# EAGLE design Watch-It-TOP (EAGLE 9.5.1)
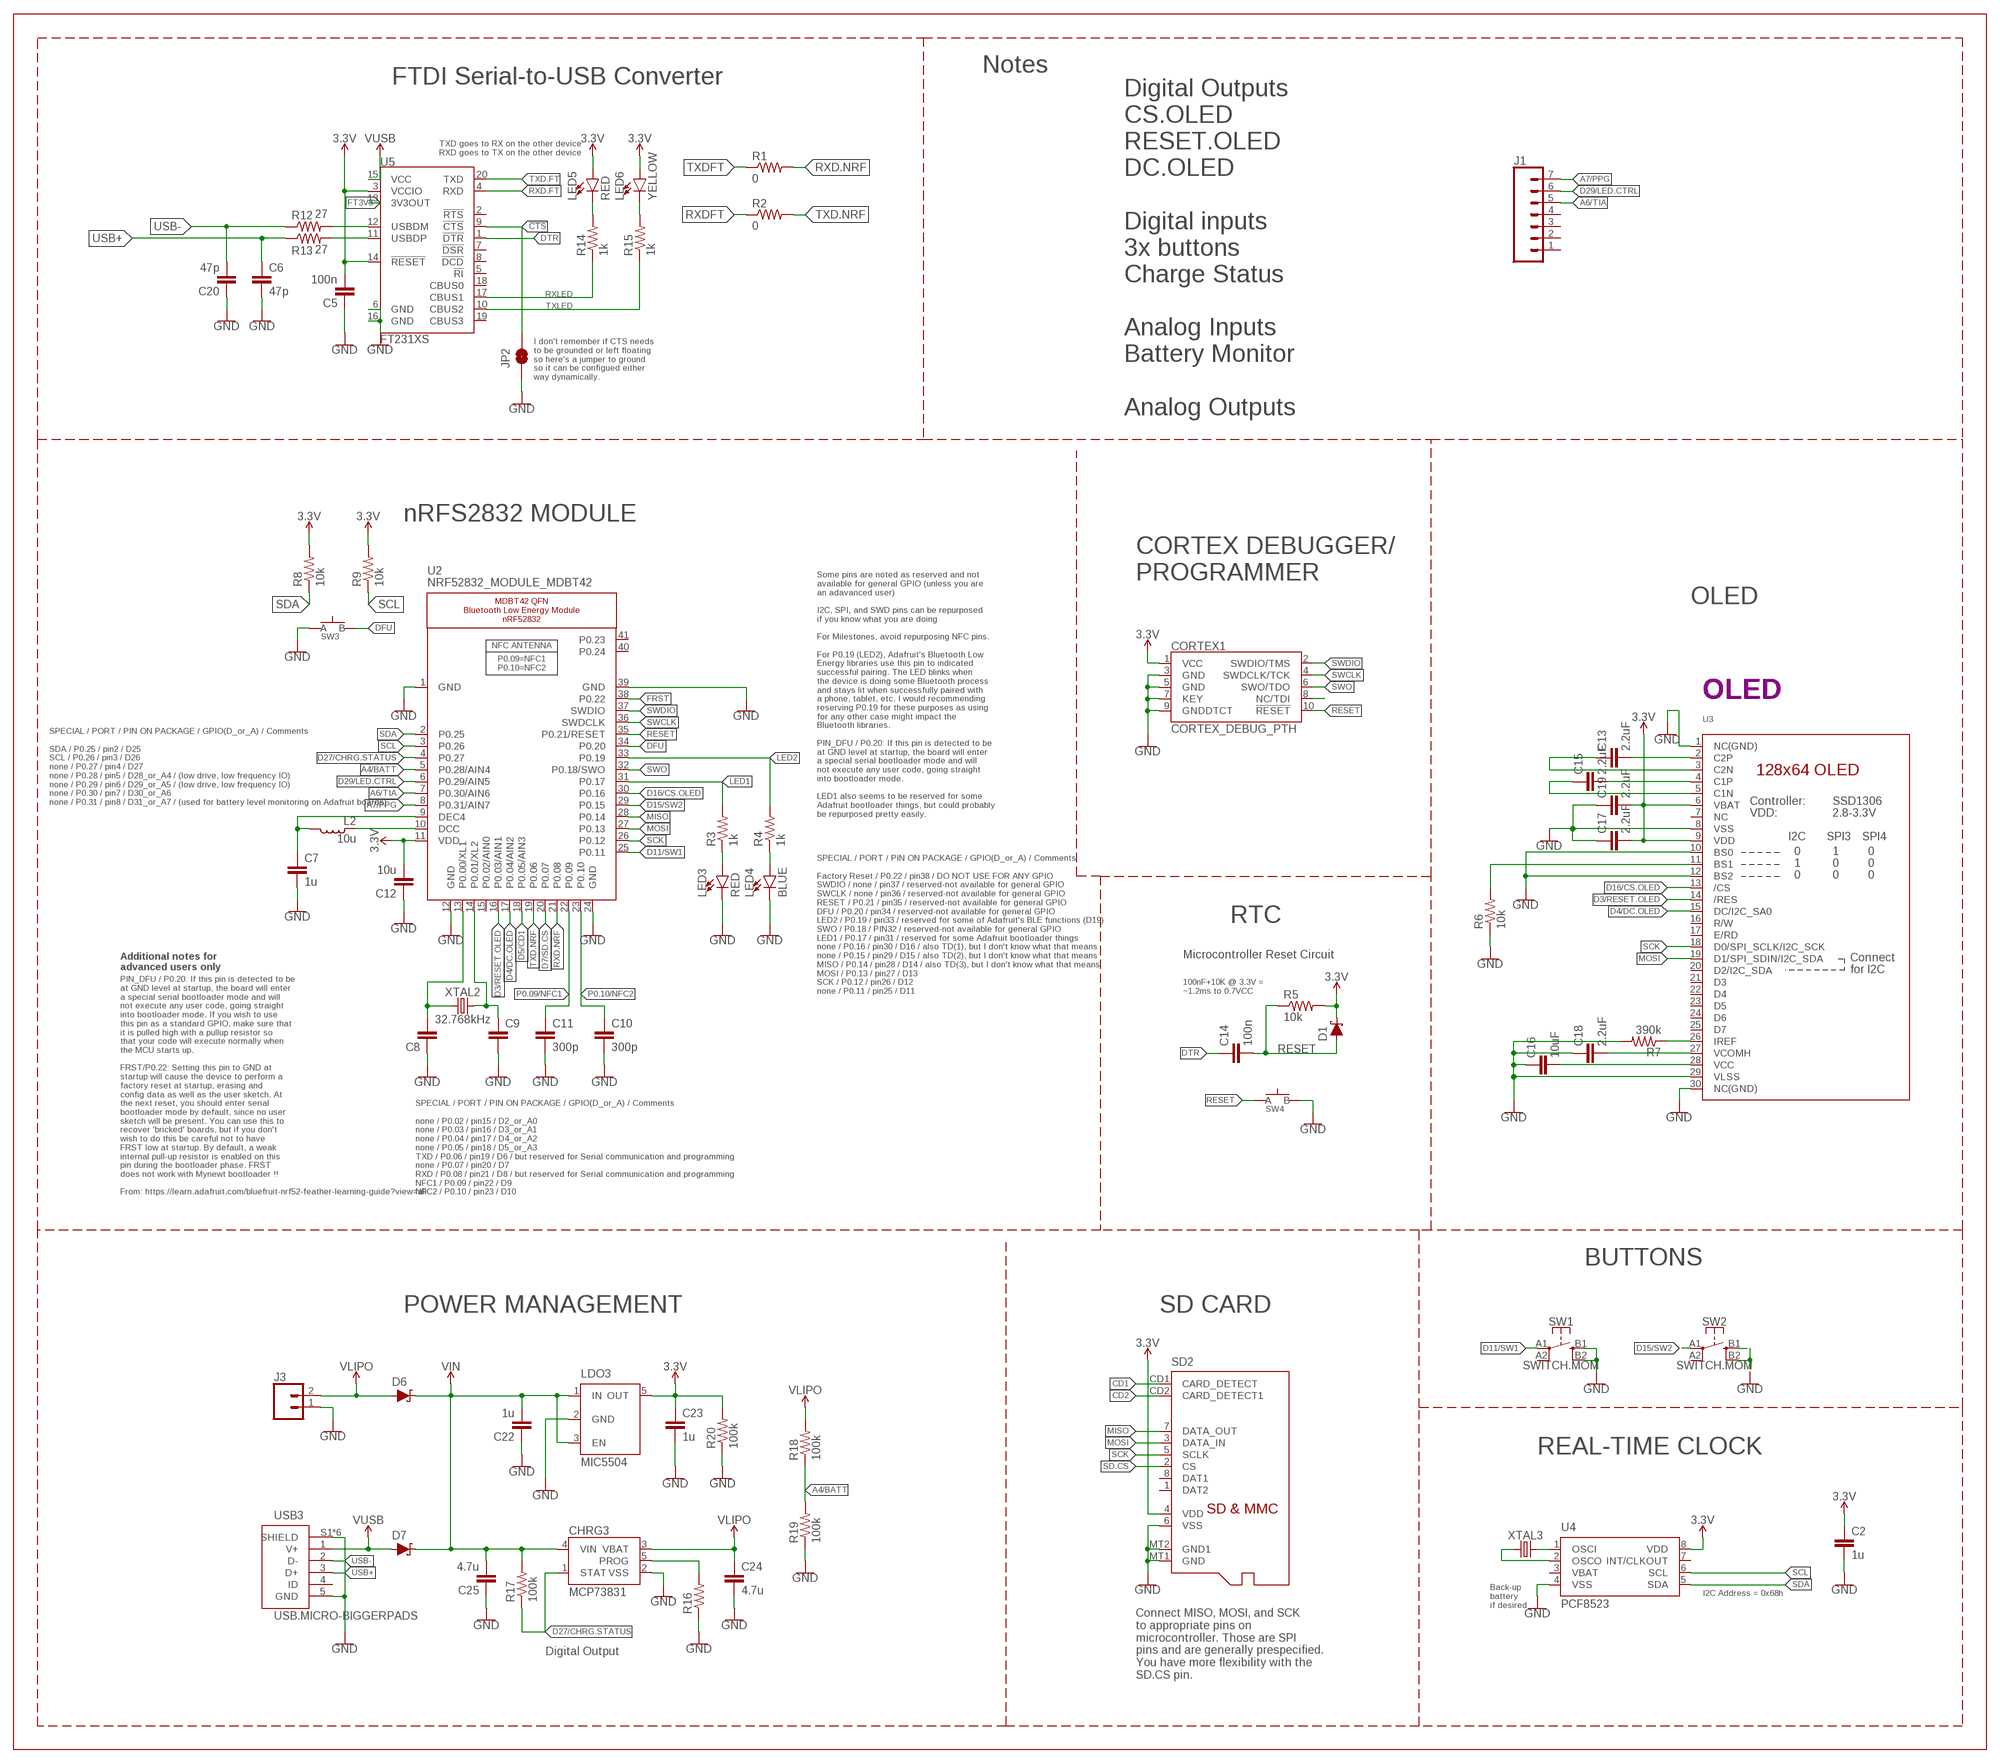
[diagram p0: schematic, sheet 1]

## Parts
C2  1u  CAPACITOR0603  [C0603]
C5  100n  CAPACITOR0603  [C0603]
C6  47p  CAPACITOR0603  [C0603]
C7  1u  CAPACITOR0603  [C0603]
C8  CAPACITOR0603  [C0603]
C9  CAPACITOR0603  [C0603]
C10  300p  CAPACITOR0603  [C0603]
C11  300p  CAPACITOR0603  [C0603]
C12  10u  CAPACITOR0805  [C0805]
C13  2.2uF  CAPACITOR0402  [C0402]
C14  100n  CAPACITOR0603  [C0603]
C15  2.2uF  CAPACITOR0402  [C0402]
C16  10uF  CAPACITOR0603  [C0603]
C17  2.2uF  CAPACITOR0402  [C0402]
C18  2.2uF  CAPACITOR0402  [C0402]
C19  2.2uF  CAPACITOR0402  [C0402]
C20  47p  CAPACITOR0603  [C0603]
C22  1u  CAPACITOR0603  [C0603]
C23  1u  CAPACITOR0603  [C0603]
C24  4.7u  CAPACITOR0603  [C0603]
C25  4.7u  CAPACITOR0603  [C0603]
CHRG3  MCP73831  [SOT23-5]
CORTEX1  CORTEX_DEBUG_PTH  [2X5-PTH-1.27MM]
D1  SCHOTTKY-USC  [USC]
D6  SCHOTTKY-USC  [USC]
D7  SCHOTTKY-USC  [USC]
J1  CONN_07  [1X07]
J3  CONN_02  [1X02]
JP2  JUMPER-SMT_2_NO_SILK  [SMT-JUMPER_2_NO_SILK]
L2  10u  INDUCTOR0603  [L0603]
LDO3  MIC5504  [SOT23-5]
LED3  RED  LED0603  [LED-0603]
LED4  BLUE  LED0603  [LED-0603]
LED5  RED  LED0603  [LED-0603]
LED6  YELLOW  LED0603  [LED-0603]
R1  0  RESISTOR0603  [R0603]
R2  0  RESISTOR0603  [R0603]
R3  1k  RESISTOR0603  [R0603]
R4  1k  RESISTOR0603  [R0603]
R5  10k  RESISTOR0603  [R0603]
R6  10k  RESISTOR0603  [R0603]
R7  390k  RESISTOR0603  [R0603]
R8  10k  RESISTOR0603  [R0603]
R9  10k  RESISTOR0603  [R0603]
R12  27  RESISTOR0603  [R0603]
R13  27  RESISTOR0603  [R0603]
R14  1k  RESISTOR0603  [R0603]
R15  1k  RESISTOR0603  [R0603]
R16  RESISTOR0603  [R0603]
R17  100k  RESISTOR0603  [R0603]
R18  100k  RESISTOR0603  [R0603]
R19  100k  RESISTOR0603  [R0603]
R20  100k  RESISTOR0603  [R0603]
SD2  MICROSD  [MICROSD]
SW1  SWITCH.MOM  [TACTILE_SWITCH_SMD_6.2MM_TALL]
SW2  SWITCH.MOM  [TACTILE_SWITCH_SMD_6.2MM_TALL]
SW3  SPST-PTS830GG140-COPY.1-3  [BUTTON-GULLWING]
SW4  SPST-PTS830GG140-COPY.1-3  [BUTTON-GULLWING]
U2  NRF52832_MODULE_MDBT42  [BLE_MODULE_RAYTAC_MDBT42]
U3  DISP_OLED_UG-2864HSWEG01-NO-WRAPAROUND  [UG-2864HSWEG01_0.96IN_NO-WRAPAROUND]
U4  PCF8523  [SO8]
U5  FT231XS  [SSOP20_L]
USB3  USB.MICRO-BIGGERPADS  [USB-MICRO-01.BIGGERPADS]
XTAL2  32.768kHz  CRYSTALECS-.327-12.5-12-C-TR  [2-SMD.NOLEAD.2.0MMTO1.2MM]
XTAL3  32.7680kHz  CRYSTALECS-.327-12.5-12-C-TR  [2-SMD.NOLEAD.2.0MMTO1.2MM]

## Nets
3.3V: C2.1 C5.2 C12.2 C17.2 C19.2 C23.1 CORTEX1.1(VCC) D1.-(C) LDO3.5(OUT) LED5.A LED6.A R5.2 R8.2 R9.2 R20.2 SD2.4(VDD) U2.11(VDD) U3.6(VBAT) U3.9(VDD) U4.8(VDD) U5.3(VCCIO) U5.14(!RESET)
!CTS: JP2.2 U5.9(!CTS)
A4/BATT: R18.1 R19.2 U2.5(P0.28/AIN4)
A6/TIA: J1.5 U2.7(P0.30/AIN6)
A7/PPG: J1.7 U2.8(P0.31/AIN7)
CD1: SD2.CD1(CARD_DETECT)
CD2: SD2.CD2(CARD_DETECT1)
D3/RESET.OLED: U2.16(P0.03/AIN1) U3.14(/RES)
D4/DC.OLED: U2.17(P0.04/AIN2) U3.15(DC/I2C_SA0)
D5/CD1: U2.18(P0.05/AIN3)
D7/SD.CS: U2.20(P0.07)
D11/SW1: SW1.A1 U2.25(P0.11)
D15/SW2: SW2.A1 U2.29(P0.15)
D16/CS.OLED: U2.30(P0.16) U3.13(/CS)
D27/CHRG.STATUS: CHRG3.1(STAT) R17.1 U2.4(P0.27)
D29/LED.CTRL: J1.6 U2.6(P0.29/AIN5)
DFU: SW3.3(B) U2.34(P0.20)
DTR: C14.1 U5.1(!DTR)
FRST: U2.38(P0.22)
FT3V3: U5.13(3V3OUT)
GND: C2.2 C5.1 C6.2 C7.2 C8.1 C9.2 C10.2 C11.2 C12.1 C16.1 C17.1 C18.1 C19.1 C20.1 C22.1 C23.2 C24.2 C25.1 CHRG3.2(VSS) CORTEX1.3(GND) CORTEX1.5(GND) CORTEX1.7(KEY) CORTEX1.9(GNDDTCT) J3.1 JP2.1 LDO3.2(GND) LED3.C LED4.C R6.1 R7.2 R16.1 R19.1 R20.1 SD2.6(VSS) SD2.MT1(GND) SD2.MT2(GND1) SW1.B1 SW1.B2 SW2.B1 SW2.B2 SW3.1(A) SW4.3(B) U2.1(GND) U2.12(GND) U2.24(GND) U2.39(GND) U3.1(NC(GND)) U3.8(VSS) U3.10(BS0) U3.12(BS2) U3.29(VLSS) U3.30(NC(GND)) U4.4(VSS) U5.6(GND) U5.16(GND) USB3.5(GND) USB3.S1(SHIELD) USB3.S2(SHIELD) USB3.S3(SHIELD) USB3.S4(SHIELD) USB3.S5(SHIELD) USB3.S6(SHIELD)
LED1: R3.2 U2.31(P0.17)
LED2: R4.2 U2.33(P0.19)
MISO: SD2.7(DATA_OUT) U2.28(P0.14)
MOSI: SD2.3(DATA_IN) U2.27(P0.13) U3.19(D1/SPI_SDIN/I2C_SDA)
N$1: R6.2 U3.11(BS1)
N$2: R7.1 U3.26(IREF)
N$3: C13.2 U3.2(C2P)
N$4: C8.2 U2.13(P0.00/XL1) XTAL2.P$1
N$5: C13.1 U3.3(C2N)
N$6: C9.1 U2.14(P0.01/XL2) XTAL2.P$2
N$7: C15.2 U3.4(C1P)
N$8: C15.1 U3.5(C1N)
N$9: LED3.A R3.1
N$10: LED4.A R4.1
N$11: L2.1 U2.10(DCC)
N$12: C7.1 L2.2 U2.9(DEC4)
N$13: C16.2 U3.28(VCC)
N$14: CORTEX1.8(NC/TDI)
N$15: C18.2 U3.27(VCOMH)
N$18: CHRG3.5(PROG) R16.2
N$19: U4.2(OSCO) XTAL3.P$1
N$20: U4.1(OSCI) XTAL3.P$2
N$23: R12.2 U5.12(USBDM)
N$24: R13.2 U5.11(USBDP)
N$25: LED5.C R14.2
N$26: LED6.C R15.2
P0.09/NFC1: C11.1 U2.22(P0.09)
P0.10/NFC2: C10.1 U2.23(P0.10)
RESET: C14.2 CORTEX1.10(!RESET) D1.+(A) R5.1 SW4.1(A) U2.35(P0.21/RESET)
RXD.FT: U5.4(RXD)
RXD.NRF: R1.2 U2.21(P0.08)
RXDFT: R2.1
RXLED: R14.1 U5.17(CBUS1)
SCK: SD2.5(SCLK) U2.26(P0.12) U3.18(D0/SPI_SCLK/I2C_SCK)
SCL: R9.1 U2.3(P0.26) U4.6(SCL)
SD.CS: SD2.2(CS)
SDA: R8.1 U2.2(P0.25) U4.5(SDA)
SWCLK: CORTEX1.4(SWDCLK/TCK) U2.36(SWDCLK)
SWDIO: CORTEX1.2(SWDIO/TMS) U2.37(SWDIO)
SWO: CORTEX1.6(SWO/TDO) U2.32(P0.18/SWO)
TXD.FT: U5.20(TXD)
TXD.NRF: R2.2 U2.19(P0.06)
TXDFT: R1.1
TXLED: R15.1 U5.10(CBUS2)
USB+: C6.1 R13.1 USB3.3(D+)
USB-: C20.2 R12.1 USB3.2(D-)
V_USB: D7.+(A) U5.15(VCC) USB3.1(V+) ; supply symbol labelled VUSB
VIN: C22.2 C25.2 CHRG3.4(VIN) D6.-(C) D7.-(C) LDO3.1(IN) LDO3.3(EN) R17.2
VLIPO: C24.1 CHRG3.3(VBAT) D6.+(A) J3.2 R18.2
Unconnected: J1.1 J1.2 J1.3 J1.4 SD2.1(DAT2) SD2.8(DAT1) SW1.A2 SW2.A2 U2.15(P0.02/AIN0) U2.40(P0.24) U2.41(P0.23) U3.7(NC) U3.16(R/W) U3.17(E/RD) U3.20(D2/I2C_SDA) U3.21(D3) U3.22(D4) U3.23(D5) U3.24(D6) U3.25(D7) U4.7(INT/CLKOUT) U5.2(!RTS) U5.5(!RI) U5.7(!DSR) U5.8(!DCD) U5.18(CBUS0) U5.19(CBUS3) USB3.4(ID)

## Notes on the sheet
- Notes
- FTDI Serial-to-USB Converter
- TXD goes to RX on the other device
  RXD goes to TX on the other device
- I don't remember if CTS needs
  to be grounded or left floating
  so here's a jumper to ground
  so it can be configued either
  way dynamically.
- Digital Outputs
  CS.OLED
  RESET.OLED
  DC.OLED
  
  Digital inputs
  3x buttons
  Charge Status
  
  Analog Inputs
  Battery Monitor
  
  Analog Outputs
- nRFS2832 MODULE
- CORTEX DEBUGGER/ 
  PROGRAMMER
- OLED
- OLED
- SPECIAL / PORT / PIN ON PACKAGE / GPIO(D_or_A) / Comments
  
  SDA / P0.25 / pin2 / D25
  SCL / P0.26 / pin3 / D26
  none / P0.27 / pin4 / D27
  none / P0.28 / pin5 / D28_or_A4 / (low drive, low frequency IO)
  none / P0.29 / pin6 / D29_or_A5 / (low drive, low frequency IO)
  none / P0.30 / pin7 / D30_or_A6
  none / P0.31 / pin8 / D31_or_A7 / (used for battery level monitoring on Adafruit boards)
- Some pins are noted as reserved and not
  available for general GPIO (unless you are
  an adavanced user)
  
  I2C, SPI, and SWD pins can be repurposed
  if you know what you are doing
  
  For Milestones, avoid repurposing NFC pins.
  
  For P0.19 (LED2), Adafruit's Bluetooth Low
  Energy libraries use this pin to indicated
  successful pairing. The LED blinks when
  the device is doing some Bluetooth process
  and stays lit when successfully paired with
  a phone, tablet, etc. I would recommending
  reserving P0.19 for these purposes as using
  for any other case might impact the
  Bluetooth libraries.
  
  PIN_DFU / P0.20: If this pin is detected to be
  at GND level at startup, the board will enter
  a special serial bootloader mode and will
  not execute any user code, going straight
  into bootloader mode.
  
  LED1 also seems to be reserved for some
  Adafruit bootloader things, but could probably
  be repurposed pretty easily.
- RTC
- Microcontroller Reset Circuit
- Additional notes for
  advanced users only
- SPECIAL / PORT / PIN ON PACKAGE / GPIO(D_or_A) / Comments
  
  Factory Reset / P0.22 / pin38 / DO NOT USE FOR ANY GPIO
  SWDIO / none / pin37 / reserved-not available for general GPIO
  SWCLK / none / pin36 / reserved-not available for general GPIO
  RESET / P0.21 / pin35 / reserved-not available for general GPIO
  DFU / P0.20 / pin34 / reserved-not available for general GPIO
  LED2 / P0.19 / pin33 / reserved for some of Adafruit's BLE functions (D19)
  SWO / P0.18 / PIN32 / reserved-not available for general GPIO
  LED1 / P0.17 / pin31 / reserved for some Adafruit bootloader things
  none / P0.16 / pin30 / D16 / also TD(1), but I don't know what that means
  none / P0.15 / pin29 / D15 / also TD(2), but I don't know what that means
  MISO / P0.14 / pin28 / D14 / also TD(3), but I don't know what that means
  MOSI / P0.13 / pin27 / D13
  SCK / P0.12 / pin26 / D12
  none / P0.11 / pin25 / D11
- 100nF+10K @ 3.3V =
  ~1.2ms to 0.7VCC
- PIN_DFU / P0.20: If this pin is detected to be
  at GND level at startup, the board will enter
  a special serial bootloader mode and will
  not execute any user code, going straight
  into bootloader mode. If you wish to use
  this pin as a standard GPIO, make sure that
  it is pulled high with a pullup resistor so
  that your code will execute normally when
  the MCU starts up.
  
  FRST/P0.22: Setting this pin to GND at
  startup will cause the device to perform a
  factory reset at startup, erasing and
  config data as well as the user sketch. At
  the next reset, you should enter serial
  bootloader mode by default, since no user
  sketch will be present. You can use this to
  recover 'bricked' boards, but if you don't
  wish to do this be careful not to have
  FRST low at startup. By default, a weak
  internal pull-up resistor is enabled on this
  pin during the bootloader phase. FRST
  does not work with Mynewt bootloader !!
  
  From: https://learn.adafruit.com/bluefruit-nrf52-feather-learning-guide?view=all
- SPECIAL / PORT / PIN ON PACKAGE / GPIO(D_or_A) / Comments
  
  none / P0.02 / pin15 / D2_or_A0
  none / P0.03 / pin16 / D3_or_A1
  none / P0.04 / pin17 / D4_or_A2
  none / P0.05 / pin18 / D5_or_A3
  TXD / P0.06 / pin19 / D6 / but reserved for Serial communication and programming
  none / P0.07 / pin20 / D7
  RXD / P0.08 / pin21 / D8 / but reserved for Serial communication and programming
  NFC1 / P0.09 / pin22 / D9
  NFC2 / P0.10 / pin23 / D10
- BUTTONS
- POWER MANAGEMENT | SD CARD
- REAL-TIME CLOCK
- I2C Address = 0x68h
- Back-up
  battery
  if desired
- Digital Output
- Connect MISO, MOSI, and SCK
  to appropriate pins on
  microcontroller. Those are SPI
  pins and are generally prespecified.
  You have more flexibility with the
  SD.CS pin.

## Power pins joined to a net without a drawn wire
VBAT: U4.3(VBAT)

## Library data of the parts
C2 C5-C20 C22-C25 = LinnesLab-Passives:CAPACITOR
CHRG3 = LinnesLab-Power:MCP73831: MCP73831T Li-Ion, Li-Pol Controller Miniature single cell, fully integrated Li-Ion, Li-polymer charge management controller Datasheet <http://ww1.microchip.com/downloads/en/DeviceDoc/20001984g.pdf> SparkFun Products: SparkFun ESP32 Thing <https://www.sparkfun.com/products/13907> SparkFun 9DoF Razor IMU M0 <https://www.sparkfun.com/products/14001>; PROD_ID: IC-09995
CORTEX1 = LinnesLab-Connectors:CORTEX_DEBUG: Cortex Debug Connector - 10 pin Supports JTAG debug, Serial Wire debug, and Serial Wire Viewer. PTH and SMD connector options available. General Connector Information <http://infocenter.arm.com/help/topic/com.arm.doc.faqs/attached/13634/cortex_debug_connectors.pdf> Products: PTH Connector <http://www.digikey.com/product-detail/en/cnc-tech/3220-10-0100-00/1175-1627-ND/3883661> -via Digi-Key SparkFun PSoc <https://www.sparkfun.com/products/13229> SparkFun T <https://www.sparkfun.com/products/13810>
D1 D6 D7 = LinnesLab-DiscreteSemi:SCHOTTKY: Schottky diode A Schottky diode is a semiconductor diode which has a low forward voltage drop and a very fast switching action. Example: Digi-Key Part Number: RB161MM-20CT-ND
J1 = LinnesLab-Connectors:CONN_07: Multi connection point. Often used as Generic Header-pin footprint for 0.1 inch spaced/style header connections On any of the 0.1 inch spaced packages, you can populate with these: Break Away Headers - Straight <https://www.sparkfun.com/products/116> (PRT-00116) Break Away Male Headers - Right Angle <https://www.sparkfun.com/products/553> (PRT-00553) Female Headers <https://www.sparkfun.com/products/115> (PRT-00115) Break Away Headers - Machine Pin <https://www.sparkfun.com/products/117> (PRT-00117) Break Away Female Headers - Swiss Machine Pin <https://www.sparkfun.com/products/743> (PRT-00743) For SCREWTERMINALS and SPRING TERMINALS visit here: Screw Terimnals on SparkFun.com <https://www.sparkfun.com/search/results?term=Screw+Terminals> (5mm/3.5mm/2.54mm spacing) This device is also useful as a general connection point to wire up your design to another part of your project. Our various solder wires solder well into these plated through hole pads. Hook-Up Wire - Assortment (Stranded, 22 AWG) <https://www.sparkfun.com/products/11375> (PRT-11375) Hook-Up Wire - Assortment (Solid Core, 22 AWG) <https://www.sparkfun.com/products/11367> (PRT-11367) View the entire wire category on our website here <https://www.sparkfun.com/categories/141> Special notes: Molex polarized connector foot print use with SKU : PRT-08231 with associated crimp pins and housings. 1MM SMD Version SKU: PRT-10208 NOTES ON THE VARIANTS LOCK and LOCK_LONGPADS... This footprint was designed to help hold the alignment of a through-hole component (i.e. 6-pin header) while soldering it into place. You may notice that each hole has been shifted either up or down by 0.005 of an inch from it's more standard position (which is a perfectly straight line). This slight alteration caused the pins (the squares in the middle) to touch the edges of the holes. Because they are alternating, it causes a "brace" to hold the component in place. 0.005 has proven to be the perfect amount of "off-center" position when using our standard breakaway headers. Although looks a little odd when you look at the bare footprint, once you have a header in there, the alteration is very hard to notice. Also,if you push a header all the way into place, it is covered up entirely on the bottom side.
J3 = LinnesLab-Connectors:CONN_02: Multi connection point. Often used as Generic Header-pin footprint for 0.1 inch spaced/style header connections On any of the 0.1 inch spaced packages, you can populate with these: Break Away Headers - Straight <https://www.sparkfun.com/products/116> (PRT-00116) Break Away Male Headers - Right Angle <https://www.sparkfun.com/products/553> (PRT-00553) Female Headers <https://www.sparkfun.com/products/115> (PRT-00115) Break Away Headers - Machine Pin <https://www.sparkfun.com/products/117> (PRT-00117) Break Away Female Headers - Swiss Machine Pin <https://www.sparkfun.com/products/743> (PRT-00743) For SCREWTERMINALS and SPRING TERMINALS visit here: Screw Terimnals on SparkFun.com <https://www.sparkfun.com/search/results?term=Screw+Terminals> (5mm/3.5mm/2.54mm spacing) This device is also useful as a general connection point to wire up your design to another part of your project. Our various solder wires solder well into these plated through hole pads. Hook-Up Wire - Assortment (Stranded, 22 AWG) <https://www.sparkfun.com/products/11375> (PRT-11375) Hook-Up Wire - Assortment (Solid Core, 22 AWG) <https://www.sparkfun.com/products/11367> (PRT-11367) View the entire wire category on our website here <https://www.sparkfun.com/categories/141> Special notes: Molex polarized connector foot print use with: PRT-08233 with associated crimp pins and housings. 2.54_SCREWTERM for use with PRT-10571. 3.5mm Screw Terminal footprints for PRT-08084 5mm Screw Terminal footprints for use with PRT-08432
JP2 = LinnesLab-Switches:JUMPER-SMT_2_NO: Normally open jumper This jumper has two pads in close proximity to each other. Apply solder to close the connection. Round pads are easier to solder for beginners, but are a lot larger. SparkFun Product that uses the round pads: SparkFun EL Sequencer <https://www.sparkfun.com/products/12781>
L2 = LinnesLab-Passives:INDUCTOR
LDO3 = LinnesLab-Power:MIC5504: MIC5504 Voltage Regulator Output Voltages: 1.0V to 3.3V Input Voltages: 2.5V to 5.5V Link to Datasheet http://ww1.microchip.com/downloads/en/DeviceDoc/MIC550X.pdf
LED3-LED6 = LinnesLab-LED:LED: LED (Generic) Standard schematic elements and footprints for 5mm, 3mm, 1206, and 0603 sized LEDs. Generic LEDs with no color specified. LTST-C190KGKT: arrow indicates cathode
R1-R9 R12-R20 = LinnesLab-Passives:RESISTOR
SD2 = LinnesLab-Connectors:MICROSD: Micro-SD / Transflash card holder with SPI pinout For the 3M # 2908-05WB-MG and/or 4UCON #19656 push-push type
SW1 SW2 = LinnesLab-Switches:SWITCH.MOM: PTS645SM43SMTR92 LFS
SW3 SW4 = LinnesLab-Switches:SPST-PTS830GG140-COPY
U2 = LinnesLab-Microcontrollers:NRF52832_MODULE_MDBT42: MDBT42 - BLE Module (nRF52832 QFN) VDD: 1.7-3.6V
U3 = LinnesLab-Displays:DISP_OLED_UG-2864HSWEG01: UG-2864HSWEG01 OLED display Both 1.3" and 0.96" models share the same FPC tab footprint, only the screen dimensions vary.
U4 = LinnesLab-Clocks:PCF8523; DIGIKEY: 568-5306-1-ND; I2C_ADDRESS: 0x68h; MFN: PCF8523T/1,118; MFN_MANUFACTURER: NXP USA Inc.
U5 = LinnesLab-DigitalIC:FT231X: FTDI FT231X Full Speed USB to Full-handshake UART This USB2.0 Full Speed IC offers a compact bridge to full handshake UART interfaces. The device is a UART, capable of operating up to 3MBaud, with low power consumption (8mA). The FT231X includes the complete FT-X series feature set and enables USB to be added into a system design quickly and easily over a UART interface. Datasheet <http://cdn.sparkfun.com/datasheets/Components/General%20IC/DS_FT231X.pdf>; DIGIKEY: 768-1156-5-ND; MFN: FT231XS-U
USB3 = LinnesLab-Connectors:USB.MICRO: DigiKey PN: 609-4613-1-ND
XTAL2 XTAL3 = LinnesLab-Clocks:CRYSTAL; DIGIKEY: XC2288CT-ND; FREQ: 32.7680KHZ; LOAD_CAP: 12.5pF

## Board
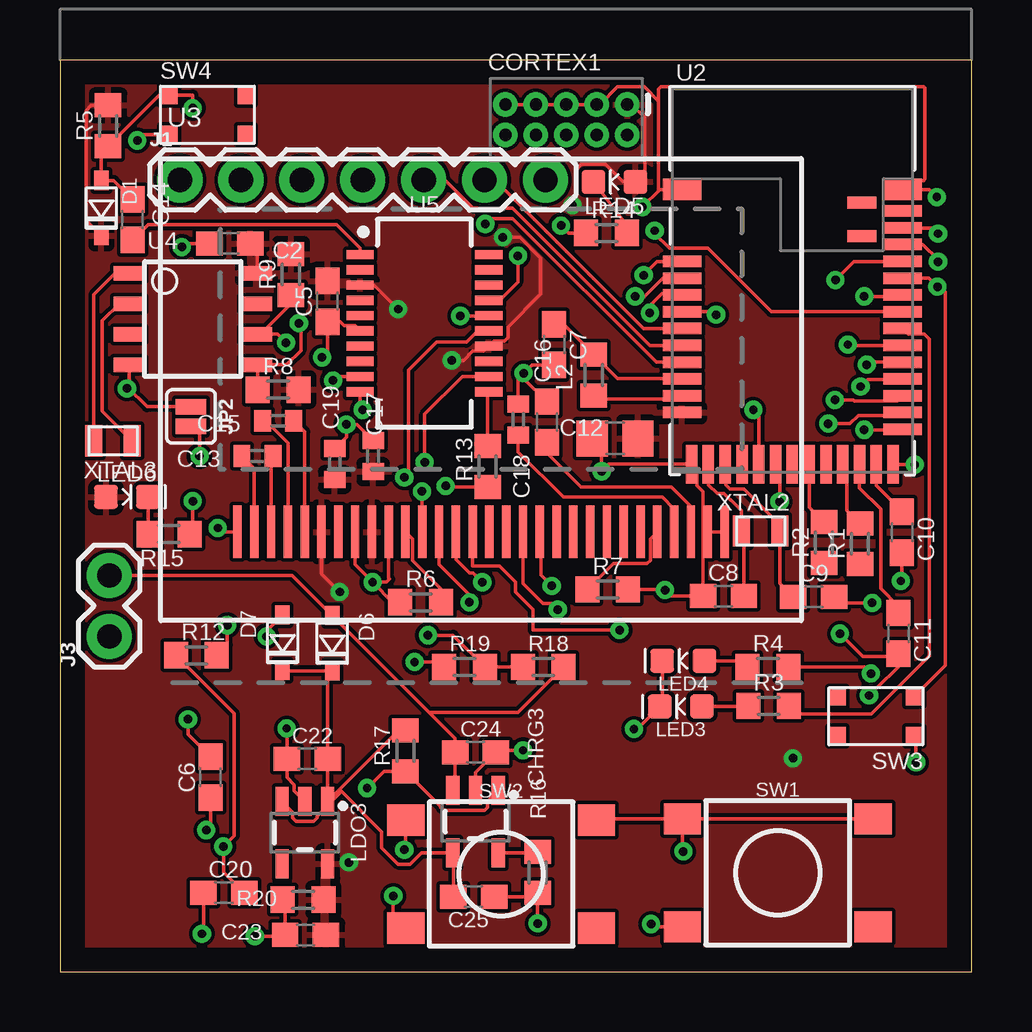
[diagram p1: board, top side]
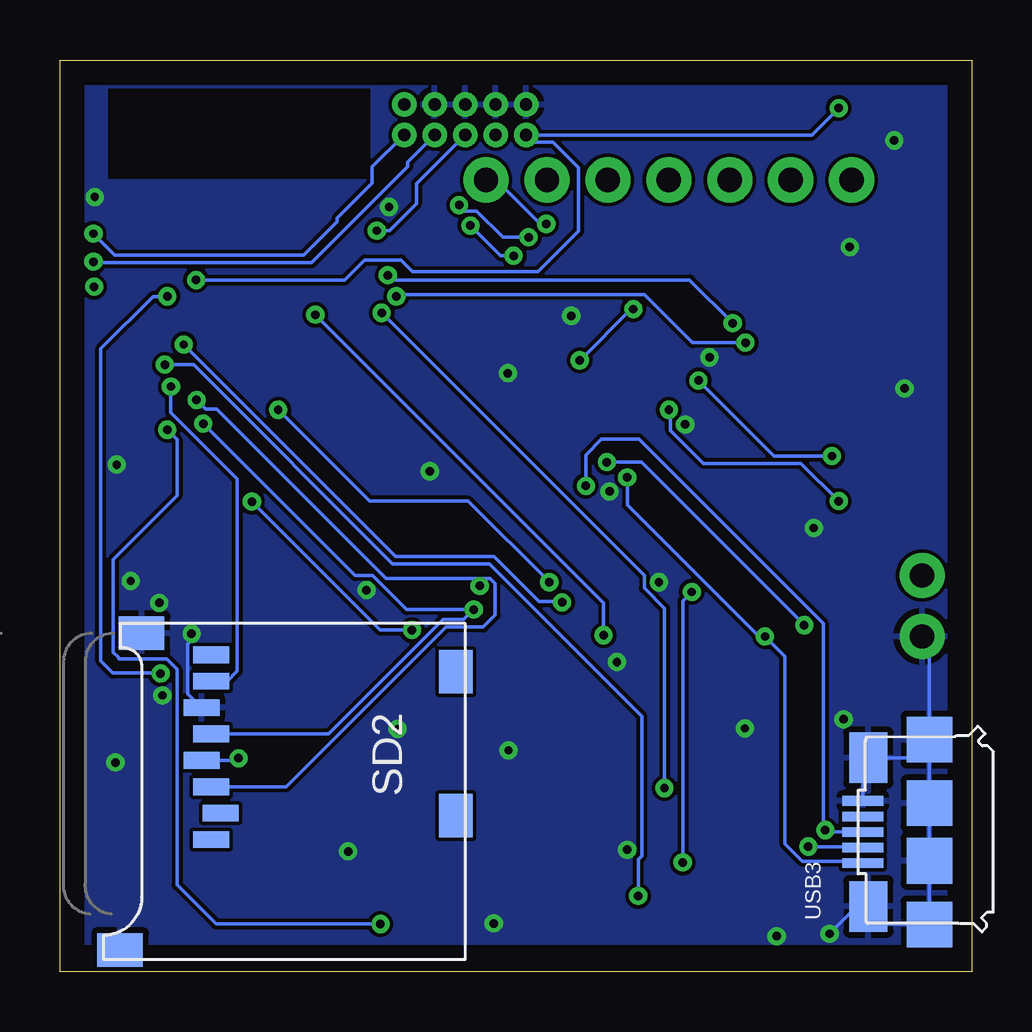
[diagram p2: board, bottom side, seen from below]

Size 38 x 38 mm. Coordinates in mm from the lower left corner, seen from the top.
Outline: 0,0 38,0 38,38 0,38 0,0
Copper layers (1*16): Top 0.035mm / dielectric 1.5mm / Bottom 0.035mm
Design rules "default": minimum track width 6mil, minimum drill 0.35mm, track to track 6mil, track to pad 6mil, pad to pad 6mil, via to via 6mil, smd to smd 6mil, copper to edge 40mil, drill to drill 6mil, minimum pad ring 10mil, minimum via ring 8mil, stop-mask expansion 4mil, vias tented up to drill 0mil, thermal gap 10mil

### Footprints (pad centres in the part's own frame; a part is rotated, then mirrored left to right if it is on the bottom)
C0603 = smd 1.1 x 1: 1 -0.85,0; 2 0.85,0
C0805 = smd 1.3 x 1.5: 1 -0.95,0; 2 0.95,0
C0402 = smd 0.7 x 0.9: 1 -0.65,0; 2 0.65,0
SOT23-5 = smd 0.55 x 1.2: 1 -0.95,-1.3; 2 0,-1.3; 3 0.95,-1.3; 4 0.95,1.3; 5 -0.95,1.3
2X5-PTH-1.27MM = drill 0.508 pad 1: 1 -2.54,-0.635; 2 -2.54,0.635; 3 -1.27,-0.635; 4 -1.27,0.635; 5 0,-0.635; 6 0,0.635; 7 1.27,-0.635; 8 1.27,0.635; 9 2.54,-0.635; 10 2.54,0.635
USC = smd 0.8 x 0.6: + -1.15,0; - 1.15,0
1X07 = drill 1.016 pad 1.88: 1 0,0; 2 2.54,0; 3 5.08,0; 4 7.62,0; 5 10.16,0; 6 12.7,0; 7 15.24,0
1X02 = drill 1.016 pad 1.88: 1 0,0; 2 2.54,0
SMT-JUMPER_2_NO_SILK = smd 0.635 x 1.27: 1 -0.406,0; 2 0.406,0
L0603 = smd 1 x 1.1: 1 -0.85,0; 2 0.85,0
LED-0603 = smd 1 x 1: A -0.877,0; C 0.877,0
R0603 = smd 1 x 1.1: 1 -0.85,0; 2 0.85,0
MICROSD = smd 0.7 x 1.5: 1 9,-10.64; 2 7.9,-10.24; 3 6.8,-10.64; 4 5.7,-11.04; 5 4.6,-10.64; 6 3.5,-11.04; 7 2.4,-10.64; 8 1.3,-10.64 | smd 1.8 x 1.4: CD1 2,-0.44; CD2 8,-0.44 | smd 1.4 x 1.9: MT1 0.4,-13.54; MT2 13.6,-14.44
TACTILE_SWITCH_SMD_6.2MM_TALL = smd 1.55 x 1.3: A1 -3.975,-2.25; A2 3.975,-2.25; B1 -3.975,2.25; B2 3.975,2.25
BUTTON-GULLWING = smd 0.7 x 0.75: 1 -1.6,0.825; 2 1.6,0.825; 3 -1.6,-0.825; 4 1.6,-0.825
BLE_MODULE_RAYTAC_MDBT42 = smd 1.6 x 0.9: 1 -4.6,3.8; 39 4.6,3.8 | smd 1.6 x 0.48: 2 -4.6,0.8; 3 -4.6,0.1; 4 -4.6,-0.6; 5 -4.6,-1.3; 6 -4.6,-2; 7 -4.6,-2.7; 8 -4.6,-3.4; 9 -4.6,-4.1; 10 -4.6,-4.8; 11 -4.6,-5.5; 25 4.6,-6.2; 26 4.6,-5.5; 27 4.6,-4.8; 28 4.6,-4.1; 29 4.6,-3.4; 30 4.6,-2.7; 31 4.6,-2; 32 4.6,-1.3; 33 4.6,-0.6; 34 4.6,0.1; 35 4.6,0.8; 36 4.6,1.5; 37 4.6,2.2; 38 4.6,2.9 | smd 0.48 x 1.6: 12 -4.2,-7.65; 13 -3.5,-7.65; 14 -2.8,-7.65; 15 -2.1,-7.65; 16 -1.4,-7.65; 17 -0.7,-7.65; 18 0,-7.65; 19 0.7,-7.65; 20 1.4,-7.65; 21 2.1,-7.65; 22 2.8,-7.65; 23 3.5,-7.65; 24 4.2,-7.65 | smd 1.2 x 0.5: 40 2.9,3.25; 41 2.9,1.85
UG-2864HSWEG01_0.96IN_NO-WRAPAROUND = smd 0.35 x 2.2: 1 -10.15,-1.2; 2 -9.45,-1.2; 3 -8.75,-1.2; 4 -8.05,-1.2; 5 -7.35,-1.2; 6 -6.65,-1.2; 7 -5.95,-1.2; 8 -5.25,-1.2; 9 -4.55,-1.2; 10 -3.85,-1.2; 11 -3.15,-1.2; 12 -2.45,-1.2; 13 -1.75,-1.2; 14 -1.05,-1.2; 15 -0.35,-1.2; 16 0.35,-1.2; 17 1.05,-1.2; 18 1.75,-1.2; 19 2.45,-1.2; 20 3.15,-1.2; 21 3.85,-1.2; 22 4.55,-1.2; 23 5.25,-1.2; 24 5.95,-1.2; 25 6.65,-1.2; 26 7.35,-1.2; 27 8.05,-1.2; 28 8.75,-1.2; 29 9.45,-1.2; 30 10.15,-1.2
SO8 = smd 1.3 x 0.6: 1 -2.65,1.905; 2 -2.65,0.635; 3 -2.65,-0.635; 4 -2.65,-1.905; 5 2.65,-1.905; 6 2.65,-0.635; 7 2.65,0.635; 8 2.65,1.905
SSOP20_L = smd 0.381 x 1.143: 1 -2.857,-2.68; 2 -2.223,-2.68; 3 -1.587,-2.68; 4 -0.953,-2.68; 5 -0.318,-2.68; 6 0.318,-2.68; 7 0.953,-2.68; 8 1.587,-2.68; 9 2.223,-2.68; 10 2.857,-2.68; 11 2.857,2.68; 12 2.223,2.68; 13 1.587,2.68; 14 0.953,2.68; 15 0.318,2.68; 16 -0.318,2.68; 17 -0.953,2.68; 18 -1.587,2.68; 19 -2.223,2.68; 20 -2.857,2.68
USB-MICRO-01.BIGGERPADS = smd 0.4 x 1.7: 1 -1.3,1.505; 2 -0.65,1.505; 3 0,1.505; 4 0.65,1.505; 5 1.3,1.505 | smd 1.9 x 1.9: S1 -3.85,-1.27; S2 -1.2,-1.27; S3 1.2,-1.27; S4 3.85,-1.27 | smd 2.1 x 1.6: S5 -3.1,1.28; S6 3.1,1.28
2-SMD.NOLEAD.2.0MMTO1.2MM = smd 0.7 x 1.3: P$1 -0.8,0; P$2 0.8,0

### Placement (x,y rotation side)
C2  7.09,30.35 180 top
C5  11.15,27.94 90 top
C6  6.27,8.1 90 top
C7  20.6,26.14 270 top
C8  27.66,15.65 0 top
C9  31.42,15.62 0 top
C10  35.1,18.31 270 top
C11  34.95,14.1 270 top
C12  23.14,22.23 0 top
C13  8.23,21.49 180 top
C14  3.02,31.34 90 top
C15  9.09,22.96 180 top
C16  20.29,22.91 270 top
C17  13.06,21.49 270 top
C18  19.1,23.01 270 top
C19  11.46,21.16 270 top
C20  6.83,3.28 0 top
C22  10.31,8.86 0 top
C23  10.24,1.52 180 top
C24  17.32,9.14 0 top
C25  17.25,3.12 180 top
CHRG3  17.32,6.25 180 top
CORTEX1  21.11,35.51 180 top
D1  1.73,31.83 270 top
D6  11.35,13.69 270 top
D7  9.27,13.72 270 top
J1  5,33 0 top
J3  2.06,13.97 90 top
JP2  5.46,23.14 270 top
L2  22.25,24.87 90 top
LDO3  10.21,5.79 180 top
LED3  25.88,11.05 180 top
LED4  25.98,12.95 180 top
LED5  23.11,32.92 180 top
LED6  2.79,19.79 0 top
R1  33.35,17.83 90 top
R2  31.85,17.88 90 top
R3  29.54,11.07 0 top
R4  29.51,12.7 0 top
R5  2.01,35.26 90 top
R6  15.04,15.39 0 top
R7  22.83,15.93 0 top
R8  9.09,24.26 0 top
R9  9.63,29.06 90 top
R12  5.69,13.18 0 top
R13  17.83,21.06 90 top
R14  22.78,30.78 0 top
R15  4.55,18.24 180 top
R16  19.91,4.14 90 top
R17  14.4,9.19 90 top
R18  20.14,12.7 0 top
R19  16.87,12.7 0 top
R20  10.13,3 0 top
SD2  21.06,14.5 270 bottom
SW1  29.92,4.11 0 top
SW2  18.39,4.06 0 top
SW3  34.01,10.64 180 top
SW4  6.15,35.71 0 top
U2  30.53,28.8 0 top
U3  17.55,19.53 0 top
U4  5.54,27.2 0 top
U5  15.19,27.03 270 top
USB3  3.02,5.82 90 bottom
XTAL2  29.21,18.36 0 top
XTAL3  2.21,22.12 180 top

### Tracks (layer width: path | path; a pad name or v marks a point on that pad's centre or on a via)
3.3V  (via drill 0.35)
  Top 0.152: U4.8 8.22,29.14 8.22,30.07 C2.1 | C5.2 10.74,28.79 | v16.33,25.48 16.82,25.48 17.2,25.86 17.65,25.86 U5.14 18.09,26.29 18.54,26.29 18.67,26.42 18.67,26.87 20.04,28.25 20.04,29.74 19.17,30.61 v18.47,30.61 | v14.1,27.61 13.1,28.61 U5.3 | CORTEX1.1 23.83,36.14 24.38,35.59 24.38,33.31 LED5.A 23.47,32.92 22.74,33.65 21.73,33.65 21.51,33.42 21.51,32.1 v21.36,31.95 | D1.- 1.09,31.31 1.09,35.89 1.31,36.1 R5.2 | U3.6 10.9,16.58 v11.66,15.82 | v12.04,4.55 11.94,4.45
  Bottom 0.152: SD2.4 30.64,8.8 v30.56,8.89 | v16.33,25.48 14.2,27.61 v14.1,27.61 | v21.36,31.95 21.11,31.71 20.64,31.71 19.54,30.61 v18.47,30.61 | v11.66,15.82 12.04,15.44 v12.04,4.55
  pour Top: 0.2,37.74 37.82,37.74 37.82,0.33 0.33,0.33
!CTS  (via drill 0.35)
  Top 0.152: U5.9 11.54,24.8 v11.38,24.64 | v5.82,21.49 5.82,22.38 JP2.2
  Bottom 0.152: v11.38,24.64 8.23,21.49 v5.82,21.49
A4/BATT  (via drill 0.35)
  Top 0.152: v27.36,27.38 27.23,27.5 U2.5 | v15.34,14.02 16.39,14.02 R19.2 R18.1
  Bottom 0.152: v27.36,27.38 15.34,15.37 v15.34,14.02
A6/TIA
  Top 0.152: U2.7 24.59,26.1 18.87,31.83 17.22,31.83 16.05,33 J1.5
A7/PPG  (via drill 0.35)
  Top 0.152: U2.8 24.86,25.4 18.87,31.39 17.96,31.39 v17.73,31.17
  Bottom 0.152: v17.73,31.17 17.97,31.17 19.81,33 J1.7
D3/RESET.OLED  (via drill 0.35)
  Top 0.152: v17.6,16.23 17.22,16.61 17.07,16.61 16.5,17.18 U3.14 | v28.91,23.42 29.13,23.19 U2.16
  Bottom 0.152: v17.6,16.23 20.98,19.61 25.09,19.61 v28.91,23.42
D4/DC.OLED  (via drill 0.35)
  Top 0.152: v23.33,14.23 19.73,14.23 19.73,15.1 19,15.83 19,16.23 18.31,16.92 17.2,16.92 U3.15 | U2.17 30,20.98 v30,19.59
  Bottom 0.152: v30,19.59 24.65,14.23 v23.33,14.23
D11/SW1  (via drill 0.35)
  Top 0.152: SW1.A1 24.75,1.86 v24.64,1.98 | U2.25 35.11,22.58 v33.53,22.58
  Bottom 0.152: v33.53,22.58 33.12,22.17 33.12,19.84 35.77,17.18 35.77,13.31 35.56,13.09 35.56,13.06 35.53,13.03 33.56,13.03 33.12,12.59 33.12,3.61 31.5,1.98 v24.64,1.98
D15/SW2  (via drill 0.35)
  Top 0.152: SW2.A1 13.89,2.33 v13.89,3.15 | v33.63,25.3 33.73,25.4 U2.29
  Bottom 0.152: v13.89,3.15 13.89,4.68 13.74,4.83 13.74,10.64 20.09,16.99 24.13,16.99 32.44,25.3 v33.63,25.3
D16/CS.OLED  (via drill 0.35)
  Top 0.152: U2.30 32.88,26.1 v32.84,26.14 | v17.07,15.39 17.07,15.7 15.8,16.96 U3.13
  Bottom 0.152: v32.84,26.14 24,17.3 19.91,17.3 18.04,15.42 17.09,15.42 v17.07,15.39
D27/CHRG.STATUS  (via drill 0.35)
  Top 0.152: CHRG3.1 17.83,7.1 17.83,6.85 17.69,6.72 16,6.72 15.87,6.85 15.87,6.88 R17.1 13.5,8.35 v12.8,7.64 | U2.4 25.88,28.25 25.09,28.25 24.59,27.75 v24.59,27.46
  Bottom 0.152: v24.59,27.46 13.64,16.51 13.64,15.98 12.8,15.14 v12.8,7.64
D29/LED.CTRL
  Top 0.152: U2.6 24.33,26.8 18.13,33 J1.6
DFU  (via drill 0.35)
  Top 0.152: U2.34 36.22,28.9 v36.58,28.55 36.68,28.55 36.91,28.32 36.91,12.77 SW3.3
DTR
  Top 0.152: C14.1 3.67,31.14 11.53,31.14 12.51,30.16 U5.1
GND  (via drill 0.35)
  Top 0.152: U3.8 12.3,16.96 v13.03,16.23 | U3.10 13.7,16.4 13.74,16.36 13.61,16.23 v13.03,16.23 | C19.1 11.94,22.29 v11.94,22.81 12.38,22.81 C17.1 | C2.2 5.08,30.35 v5.08,30.2 | v19.33,24.94 19.1,24.71 C18.1 | C16.1 19.33,24.73 v19.33,24.94 | v19.33,24.94 19.67,25.29 C7.2 | U2.1 25.01,32.6 | 25.01,32.6 24.96,32.6 24.96,36.28 | 25.01,32.6 v24.28,31.88 | C12.1 22.58,21.83 v22.58,20.85 22.88,21.15 U2.12 26.56,20.92 26.56,20.26 26.81,20.01 26.81,18.14 | U3.30 U3.29 26.81,18.14 | 26.81,18.14 C8.1 25.48,15.65 v25.22,15.9 25.2,15.93 R7.2 | v33.86,15.37 32.02,15.37 C9.2 | U2.24 34.75,21.13 v35.64,21.13 | R6.1 13.87,15.39 v13.03,16.23 | U3.1 6.74,18.33 v6.58,18.49 | U4.4 2.89,24.4 2.83,24.35 | 2.83,24.35 v2.79,24.31 | CHRG3.2 17.32,8.29 C24.2 18.25,9.22 v19.3,9.22 | SW2.B1 14.41,5.14 v14.35,5.08 | LDO3.2 9.76,7.54 9.76,7.79 9.46,8.09 C22.1 9.46,10.12 v9.45,10.13 | R20.1 9.39,2.9 C23.2 9.34,1.47 v8.13,1.47 | C25.1 19.75,3.12 R16.1 v19.91,2.01 | SW2.B2 22.41,6.37 SW1.B1 | SW1.B2 SW1.B1 | SW1.B1 25.95,5.04 v25.98,5 | SW4.3 3.47,34.89 v3.23,34.65 | JP2.1 3.63,23.55 2.83,24.35 | C6.2 5.33,9.89 v5.33,10.52 | C20.1 5.98,1.64 v5.92,1.57 | U5.6 12.29,26.92 11.84,26.92 11.68,27.09 C5.1 11.15,25.84 v10.92,25.61 | v36.55,32.28 36.23,32.6 U2.39 35.51,32.98 36.01,32.98 36.06,33.02 36.06,36.84 36.01,36.88 25.05,36.88 24.96,36.79 24.96,36.28 | SW3.1 35.69,9.74 v35.69,8.71 | U5.16 17.86,27.33 v16.69,27.33 | LED4.C 25.11,11.15 LED3.C 24.07,10.11 v23.93,10.11 | C10.2 35.1,16.33 v35.05,16.28 | R19.1 15.81,12.9 v14.78,12.9 | 24.96,36.28 24.36,36.88 23.24,36.88 22.5,36.14 CORTEX1.3 CORTEX1.5 CORTEX1.7 CORTEX1.9 | U3.12 15.1,20 v15.09,20.02
  Top 0.152: v33.73,11.51 34.03,11.81 34.06,11.81 34.95,12.71 34.95,13.13 | C11.2 34.95,13.13 | 34.95,13.13 33.47,13.13 v32.52,14.08
  Bottom 0.152: SD2.MT1 34.7,14.21 34.7,14.38 34.59,14.48 | USB3.S4 2.5,8.92 USB3.S6 4.53,8.69 USB3.5 | USB3.S4 USB3.S3 USB3.S2 USB3.S1 3.55,1.97 USB3.S5 4.78,2.72 v5.92,1.57 | USB3.S4 1.75,13.66 J3.1 | v32.52,14.08 32.52,13.81 32.67,13.65 32.67,11.58 SD2.6
  pour Bottom: 0.56,37.47 37.39,37.47 37.39,1.17 0.48,1.17
LED1
  Top 0.152: U2.31 35.36,26.57 36.02,26.57 36.24,26.36 36.24,13.17 33.82,10.74 30.72,10.74 R3.2
LED2  (via drill 0.35)
  Top 0.152: R4.2 33.53,12.7 v33.81,12.42 | v33.53,28.14 35.07,28.14 U2.33
  Bottom 0.152: v33.81,12.42 33.83,12.44 35.79,12.44 36.3,12.94 36.3,25.96 34.11,28.14 v33.53,28.14
MISO  (via drill 0.35)
  Top 0.152: U2.28 35.1,24.68 33.67,24.68 v33.38,24.38
  Bottom 0.152: v33.38,24.38 33.38,23.29 30.61,20.52 30.61,12.65 30.61,12.52 31.03,12.1 SD2.7
MOSI  (via drill 0.35)
  Top 0.152: U3.19 20.05,18.28 20.05,16.52 v20.5,16.08 | v32.31,23.82 33.08,23.82 33.12,23.78 34.9,23.78 U2.27
  Bottom 0.152: SD2.3 28.57,7.7 21.91,14.36 20.36,14.36 19.86,14.86 19.86,16.18 20.07,16.38 20.5,16.38 | v32.31,23.82 31.93,23.44 31.48,23.44 24.42,16.38 20.5,16.38 | v20.5,16.08 20.5,16.38
N$1
  Top 0.152: U3.11 14.7,18.04 14.7,17.14 15.89,15.95 R6.2
N$2
  Top 0.152: R7.1 23.06,17 24.47,17 24.61,17.14 24.61,18.04 U3.26
N$3
  Top 0.152: C13.2 8.1,20.97 U3.2
N$4
  Top 0.152: C8.2 28.51,18.26 XTAL2.P$1 28.41,19.22 27.97,19.66 27.94,19.66 27.68,19.92 27.4,19.92 27.03,20.28 U2.13
N$5
  Top 0.152: U3.3 8.8,21.41 C13.1
N$6
  Top 0.152: U2.14 27.76,21.12 27.76,20.28 27.92,20.12 28.5,20.12 30.01,18.62 XTAL2.P$2 30.01,16.18 C9.1
N$7
  Top 0.152: U3.4 9.5,22.03 8.57,22.96 C15.2
N$8
  Top 0.152: C15.1 10.2,22.5 U3.5
N$9
  Top 0.152: LED3.A 28.66,11.05 R3.1
N$10
  Top 0.152: LED4.A 28.41,12.95 R4.1
N$11
  Top 0.152: L2.1 22.39,23.87 25.8,23.87 U2.10
N$12
  Top 0.152: C7.1 20.98,26.99 L2.2 23.24,24.73 25.91,24.73 U2.9
N$13
  Top 0.152: U3.28 26.3,19.39 25.49,20.21 21.72,20.21 20.24,21.69 20.3,21.74 C16.2
N$15
  Top 0.152: U3.27 25.6,19.28 25.11,19.77 20.98,19.77 19.1,21.65 C18.2
N$18
  Top 0.152: R16.2 19.87,4.95 CHRG3.5
N$19
  Top 0.152: U4.2 2.48,27.84 1.77,27.13 1.77,23.36 XTAL3.P$1
N$20
  Top 0.152: U4.1 2.3,29.11 1.41,28.21 XTAL3.P$2
N$23  (via drill 0.35)
  Top 0.152: R12.2 6.97,13.62 v6.97,14.44 | v15.21,21.23 15.21,23.23 16.78,24.8 U5.12
  Bottom 0.152: v6.97,14.44 13.77,21.23 v15.21,21.23
N$24
  Top 0.152: R13.2 17.83,24.13 U5.11
N$25
  Top 0.152: R14.2 23.63,31.1 LED5.C
N$26
  Top 0.152: R15.2 3.67,18.26 LED6.C
P0.09/NFC1
  Top 0.152: C11.1 34.95,15.23 34.21,15.96 34.21,19.28 33.33,20.16 U2.22
P0.10/NFC2
  Top 0.152: C10.1 35.1,19.19 34.03,20.26 U2.23
RESET  (via drill 0.35)
  Top 0.152: C14.2 2.24,32.98 D1.+ 1.73,34.13 R5.1 4.14,36.54 SW4.1 5.54,36.54 v5.54,35.99 | v32.33,28.83 33.1,29.6 U2.35
  Bottom 0.152: v32.33,28.83 26.13,28.83 25.3,29.66 23.78,29.66 23.3,29.18 18.06,29.18 16.38,30.86 16.38,33.5 17.45,34.57 18.26,34.57 CORTEX1.10 6.66,34.87 v5.54,35.99
RXD.NRF
  Top 0.152: R1.2 32.81,19.22 32.81,20.98 U2.21
RXLED  (via drill 0.35)
  Top 0.152: R14.1 21.2,30.79 v20.89,31.1 | U5.17 18.32,27.98 19.09,28.75 v19.09,29.84
  Bottom 0.152: v20.89,31.1 19.63,29.84 v19.09,29.84
SCK  (via drill 0.35)
  Top 0.152: U3.18 19.3,16.18 20.14,15.34 20.5,15.34 v20.75,15.09 | v32.03,22.84 32.93,22.84 33.28,23.19 35.02,23.19 U2.26
  Bottom 0.152: SD2.5 26.8,9.9 22.03,14.67 21.17,14.67 v20.75,15.09 23.55,15.09 24.97,16.51 25.7,16.51 v32.03,22.84
SCL  (via drill 0.35)
  Top 0.152: U2.3 25.14,28.9 24.3,28.07 24.28,28.09 24.03,28.09 v23.98,28.14 | U4.6 8.36,26.57 | 8.36,26.57 9.07,26.57 v9.42,26.21 | R9.1 9.63,27.84 8.36,26.57
  Bottom 0.152: v9.42,26.21 11.63,26.21 13.64,28.22 23.9,28.22 v23.98,28.14
SDA  (via drill 0.35)
  Top 0.152: U2.2 25.91,29.59 24.89,29.59 v24.33,29.03 | R8.1 8.24,25.24 U4.5 9.45,25.3 10.05,25.89 10.05,26.94 v9.96,27.03
  Bottom 0.152: v24.33,29.03 24.13,28.82 11.76,28.82 v9.96,27.03
SWCLK  (via drill 0.35)
  Top 0.152: U2.36 35.98,30.3 36.61,29.67 v36.61,29.59
  Bottom 0.152: v36.61,29.59 36.56,29.55 27.51,29.55 23.51,33.55 23.51,33.75 CORTEX1.4
SWDIO  (via drill 0.35)
  Top 0.152: v36.61,30.76 36.38,30.99 35.15,30.99 U2.37
  Bottom 0.152: CORTEX1.2 24.98,33.54 24.98,32.87 26.44,31.41 26.44,31.27 27.84,29.87 35.72,29.87 v36.61,30.76
SWO  (via drill 0.35)
  Top 0.152: v24.79,30.89 24.79,30.76 25.4,30.15 27,30.15 29.65,27.5 U2.32
  Bottom 0.152: CORTEX1.6 23.14,32.84 23.14,32 24.26,30.89 v24.79,30.89
TXD.NRF
  Top 0.152: R2.2 31.23,19.35 U2.19
TXLED  (via drill 0.35)
  Top 0.152: R15.1 5.54,18.38 v5.54,19.61 | v12.62,23.42 12.51,23.52 U5.10
  Bottom 0.152: v5.54,19.61 7.11,21.18 11.17,21.18 12.54,22.56 12.54,23.34 v12.62,23.42
USB+  (via drill 0.35)
  Top 0.152: C6.1 6.27,6.07 v6.1,5.89 | R13.1 16.11,20.21 v16.08,20.24
  Bottom 0.152: USB3.3 6.02,5.82 v6.1,5.89 6.18,5.98 6.18,14.51 13.87,22.2 15.42,22.2 16.08,21.54 v16.08,20.24
USB-  (via drill 0.35)
  Top 0.152: R12.1 7.26,10.76 7.26,5.66 v6.82,5.22 | v6.82,5.22 v6.81,5.21 | C20.2 6.82,4.14 v6.82,5.22
  Bottom 0.152: v6.81,5.21 4.57,5.21 USB3.2
V_USB  (via drill 0.35)
  Top 0.152: D7.+ 8.61,14.21 v8.61,13.97 | U5.15 17.8,26.77 17.48,26.77 16.95,26.23 15.69,26.23 14.53,25.07 14.53,20.78 v14.35,20.6
  Bottom 0.152: USB3.1 4.61,4.6 7.06,4.6 7.77,5.31 7.77,13.13 v8.61,13.97 8.87,13.97 14.35,19.46 v14.35,20.6
VIN
  Top 0.152: D7.- 9.3,12.54 D6.- 11.16,12.35 C22.2 LDO3.1 | R17.2 14.11,10.04 LDO3.1 | LDO3.1 11.25,7 | C25.2 16.4,4.92 CHRG3.4 15.08,4.95 14.6,4.47 14.1,4.47 13.41,5.16 13.41,5.83 11.74,7.5 11.25,7 | 11.25,7 10.71,6.47 10.71,6.4 10.58,6.26 9.84,6.26 9.71,6.4 9.71,6.64 LDO3.3
VLIPO
  Top 0.152: 15.38,10.81 D6.+ 9.68,16.51 J3.2 | 15.38,10.81 16.47,9.72 C24.1 16.47,7.65 CHRG3.3 | R18.2 19.1,10.81 15.38,10.81